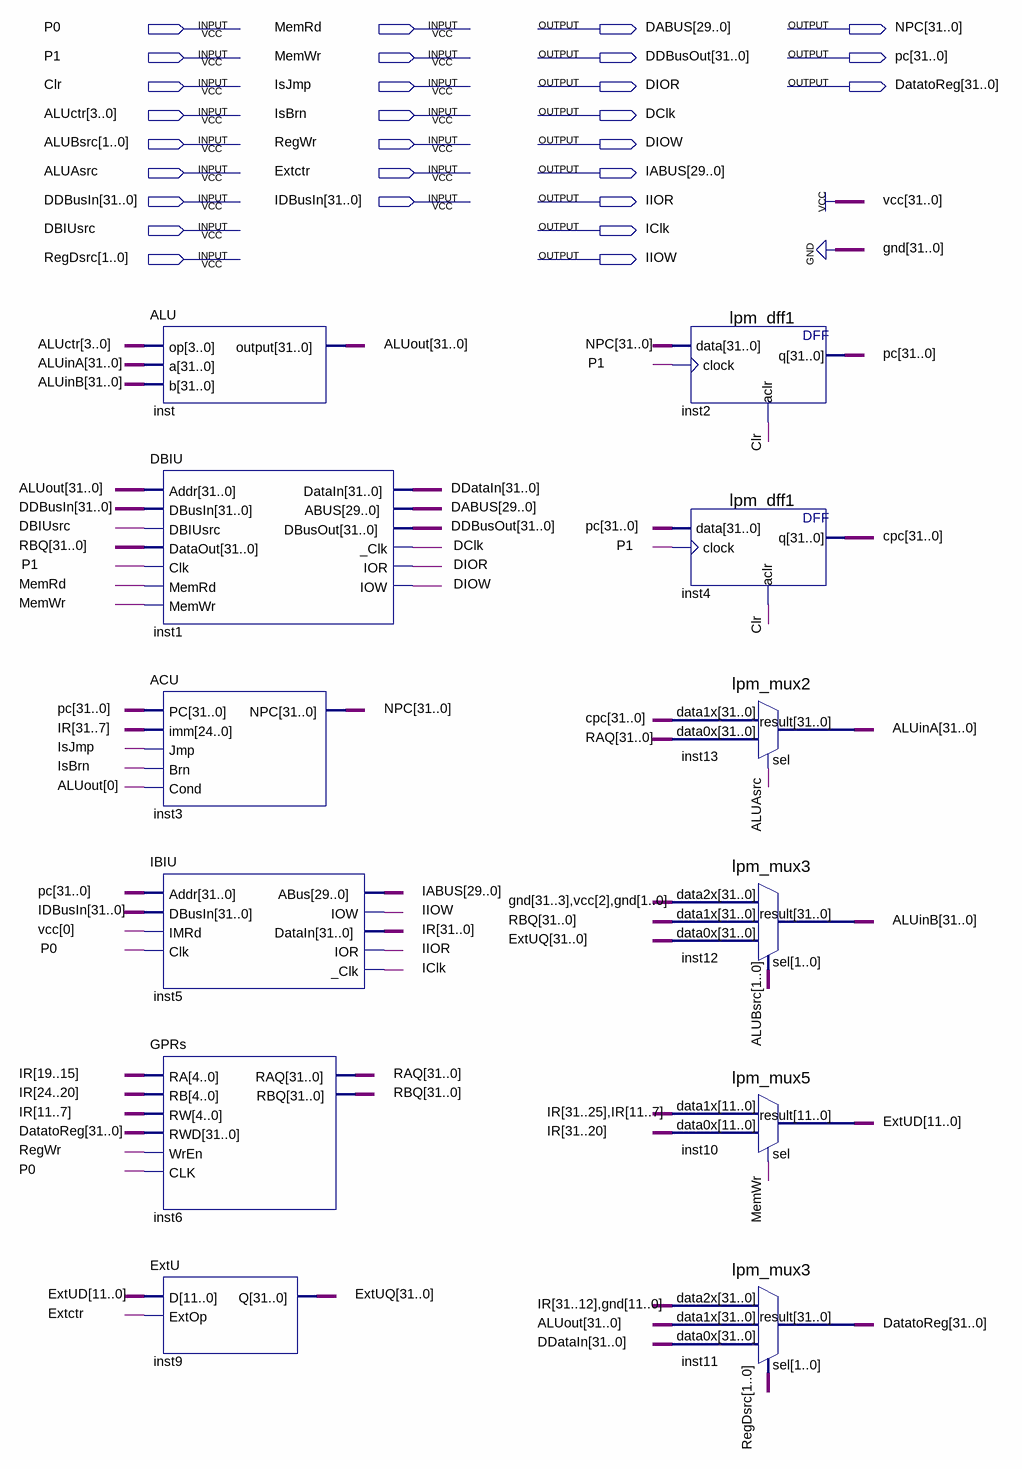
[diagram p0: schematic sheet]
// Quartus schematic DataPath.bdf as structural Verilog: 12 symbols, 28 pins
module DataPath (
  input  P0,
  input  MemRd,
  input  P1,
  input  MemWr,
  input  Clr,
  input  IsJmp,
  input  [3:0] ALUctr,
  input  IsBrn,
  input  [1:0] ALUBsrc,
  input  RegWr,
  input  ALUAsrc,
  input  Extctr,
  input  [31:0] DDBusIn,
  input  [31:0] IDBusIn,
  input  DBIUsrc,
  input  [1:0] RegDsrc,
  output [29:0] DABUS,
  output [31:0] NPC,
  output [31:0] DDBusOut,
  output [31:0] pc,
  output DIOR,
  output [31:0] DatatoReg,
  output DClk,
  output DIOW,
  output [29:0] IABUS,
  output IIOR,
  output IClk,
  output IIOW
);

  wire [11:0] ExtUD;
  wire [31:0] ALUinA, ALUinB, ALUout, cpc, DDataIn, ExtUQ, IR, RAQ, RBQ;

  ALU inst (.op(ALUctr), .a(ALUinA), .b(ALUinB), .\output (ALUout));
  DBIU inst1 (
    .Addr(ALUout), .DBusIn(DDBusIn), .DBIUsrc(DBIUsrc), .DataOut(RBQ), .Clk(P1), .MemRd(MemRd),
    .MemWr(MemWr), .DataIn(DDataIn), .ABUS(DABUS), .DBusOut(DDBusOut), ._Clk(DClk), .IOR(DIOR), .IOW(DIOW));
  ACU inst3 (.PC(pc), .imm(IR[31:7]), .Jmp(IsJmp), .Brn(IsBrn), .Cond(ALUout[0]), .NPC(NPC));
  IBIU inst5 (
    .Addr(pc), .DBusIn(IDBusIn), .IMRd(1'b1), .Clk(P0), .ABus(IABUS), .IOW(IIOW), .DataIn(IR), .IOR(IIOR),
    ._Clk(IClk));
  GPRs inst6 (
    .RA(IR[19:15]), .RB(IR[24:20]), .RW(IR[11:7]), .RWD(DatatoReg), .WrEn(RegWr), .CLK(P0), .RAQ(RAQ),
    .RBQ(RBQ));
  ExtU inst9 (.D(ExtUD), .ExtOp(Extctr), .Q(ExtUQ));
  lpm_dff1 inst2 (.data(NPC), .clock(P1), .aclr(Clr), .q(pc));
  lpm_dff1 inst4 (.data(pc), .clock(P1), .aclr(Clr), .q(cpc));
  lpm_mux2 inst13 (.data1x(cpc), .data0x(RAQ), .sel(ALUAsrc), .result(ALUinA));
  lpm_mux3 inst12 (
    .data2x(32'b00000000000000000000000000000100), .data1x(RBQ), .data0x(ExtUQ), .sel(ALUBsrc),
    .result(ALUinB));
  lpm_mux5 inst10 (.data1x({IR[31:25], IR[11:7]}), .data0x(IR[31:20]), .sel(MemWr), .result(ExtUD));
  lpm_mux3 inst11 (
    .data2x({IR[31:12], {12{1'b0}}}), .data1x(ALUout), .data0x(DDataIn), .sel(RegDsrc), .result(DatatoReg));
endmodule
